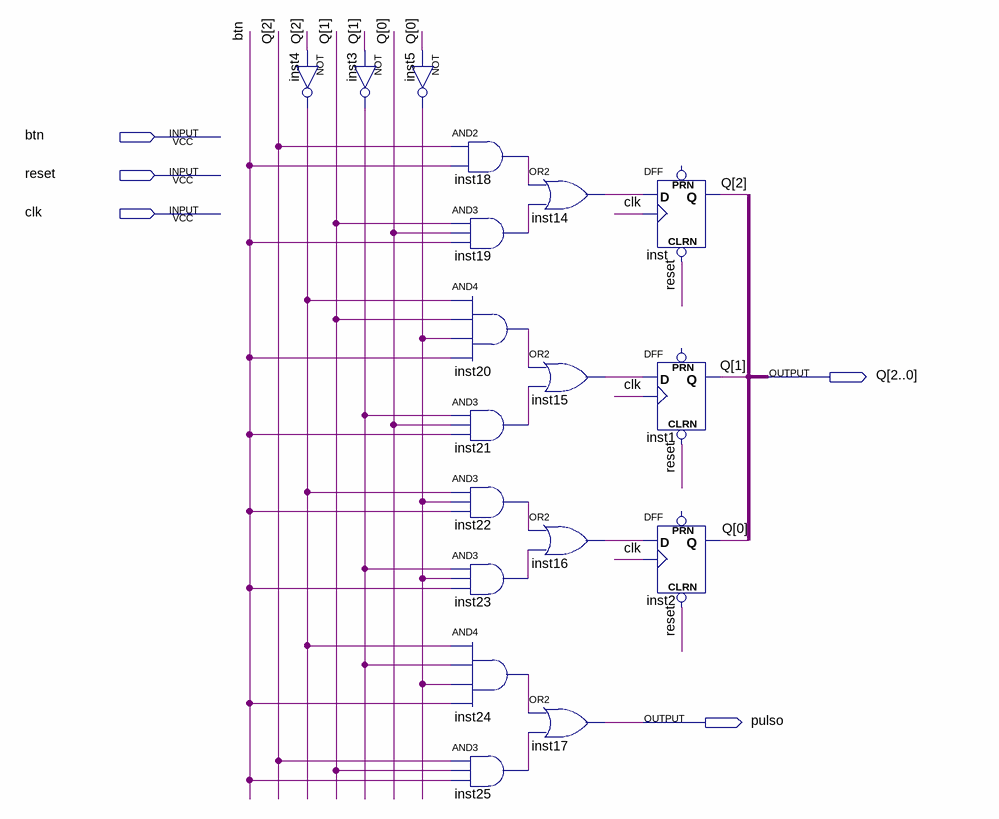
[diagram p0: schematic sheet]
// Quartus schematic CTRL_Cont6.bdf as structural Verilog: 18 symbols, 5 pins
module CTRL_Cont6 (
  input  btn,
  input  reset,
  input  clk,
  output [2:0] Q,
  output pulso
);

  wire inst3_out, inst4_out, inst5_out, inst14_out, inst15_out, inst16_out, inst18_out, inst19_out,
       inst20_out, inst21_out, inst22_out, inst23_out, inst24_out, inst25_out;

  not inst4 (inst4_out, Q[2]);
  not inst5 (inst5_out, Q[0]);
  not inst3 (inst3_out, Q[1]);
  and inst18 (inst18_out, Q[2], btn);
  and inst19 (inst19_out, Q[1], Q[0], btn);
  and inst20 (inst20_out, inst4_out, Q[1], inst5_out, btn);
  and inst21 (inst21_out, inst3_out, Q[0], btn);
  and inst22 (inst22_out, inst4_out, inst5_out, btn);
  and inst23 (inst23_out, inst3_out, inst5_out, btn);
  and inst24 (inst24_out, inst4_out, inst3_out, inst5_out, btn);
  and inst25 (inst25_out, Q[2], Q[1], btn);
  or inst14 (inst14_out, inst18_out, inst19_out);
  or inst15 (inst15_out, inst20_out, inst21_out);
  or inst16 (inst16_out, inst22_out, inst23_out);
  or inst17 (pulso, inst24_out, inst25_out);
  DFF inst (.CLRN(reset), .CLK(clk), .D(inst14_out), .Q(Q[2]));  // open: PRN
  DFF inst1 (.CLRN(reset), .CLK(clk), .D(inst15_out), .Q(Q[1]));  // open: PRN
  DFF inst2 (.CLRN(reset), .CLK(clk), .D(inst16_out), .Q(Q[0]));  // open: PRN
endmodule
